# Altium project SpaceVNXBaseBoard.PrjPcb (part 4 of 6)

## Sheet Clock.SchDoc: Clocks
size A4; Author: Carlos Barreiro; Organization: Escuela Técnica Superior de Ingeniería de Sistemas Informáticos de la Universidad Politécnica de Madrid; Address1: Campus Sur de la Universidad Politécnica de Madrid; Address2: Calle de Alan Turing, s/nº; Address3: Madrid 28031; Address4: España; DocumentNumber: 12; Revision: A; SheetNumber: 12; SheetTotal: 16
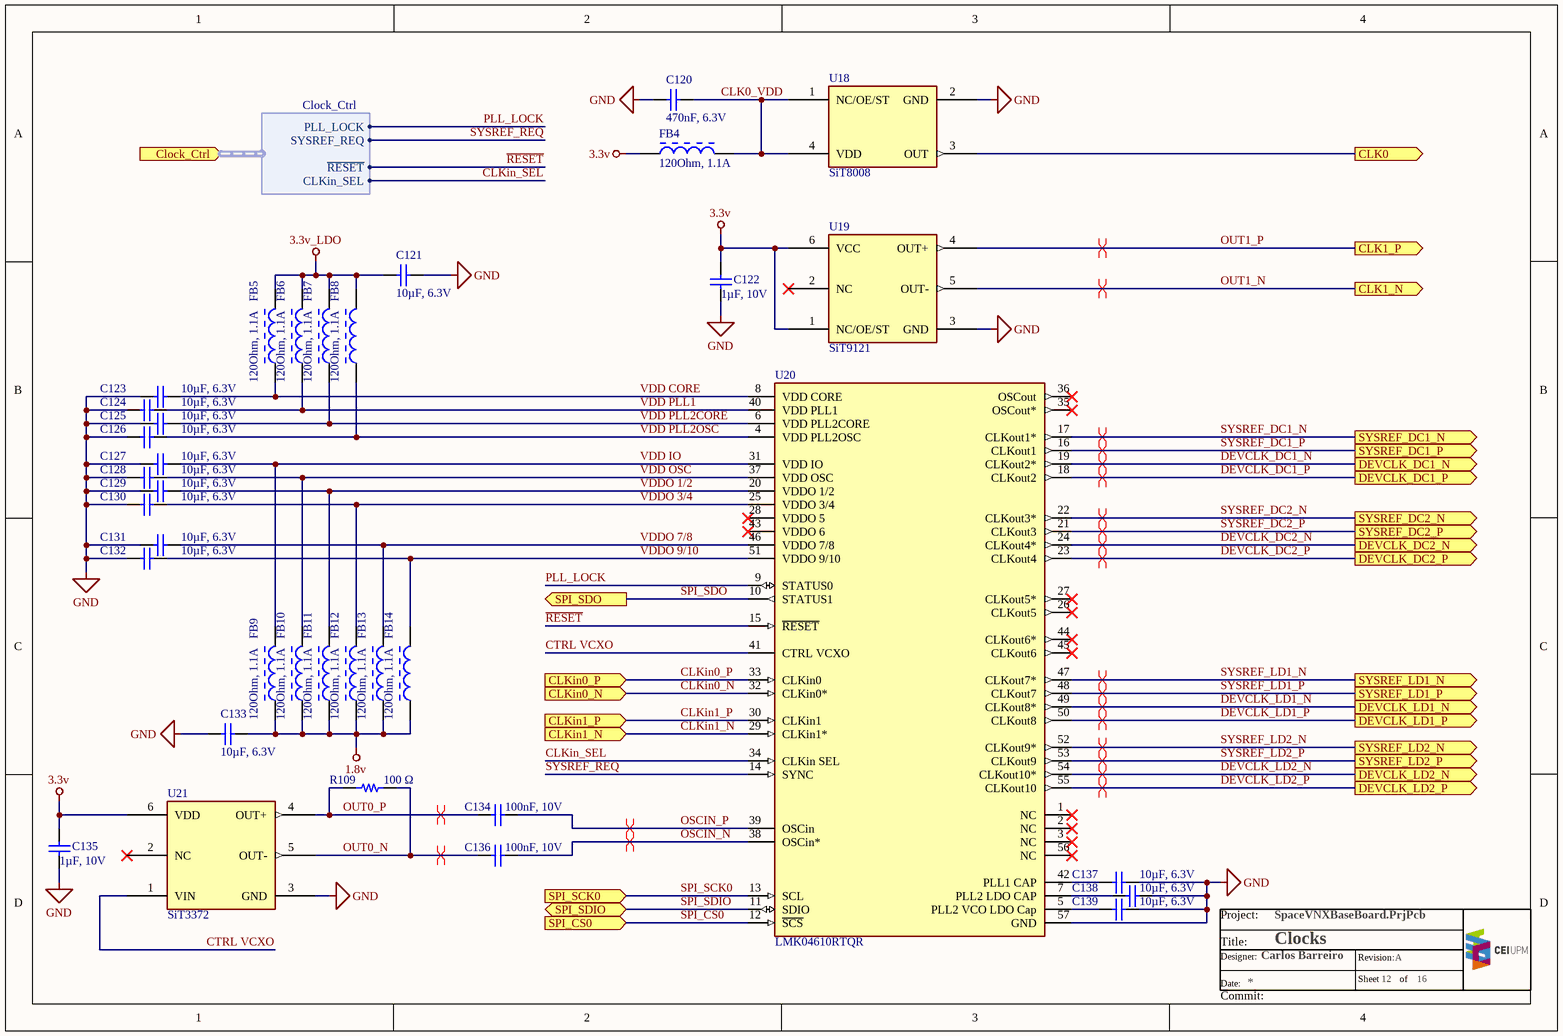
[diagram p8: Clock.SchDoc]

### Parts
C120  470nF, 6.3V  [WURTH_WCAP-CSGP_0402]
C121  10µF, 6.3V  [WURTH_WCAP-CSGP_0402]
C122  1µF, 10V  [WURTH_WCAP-CSGP_0402]
C123  10µF, 6.3V  [WURTH_WCAP-CSGP_0402]
C124  10µF, 6.3V  [WURTH_WCAP-CSGP_0402]
C125  10µF, 6.3V  [WURTH_WCAP-CSGP_0402]
C126  10µF, 6.3V  [WURTH_WCAP-CSGP_0402]
C127  10µF, 6.3V  [WURTH_WCAP-CSGP_0402]
C128  10µF, 6.3V  [WURTH_WCAP-CSGP_0402]
C129  10µF, 6.3V  [WURTH_WCAP-CSGP_0402]
C130  10µF, 6.3V  [WURTH_WCAP-CSGP_0402]
C131  10µF, 6.3V  [WURTH_WCAP-CSGP_0402]
C132  10µF, 6.3V  [WURTH_WCAP-CSGP_0402]
C133  10µF, 6.3V  [WURTH_WCAP-CSGP_0402]
C134  100nF, 10V  [WURTH_WCAP-CSGP_0402]
C135  1µF, 10V  [WURTH_WCAP-CSGP_0402]
C136  100nF, 10V  [WURTH_WCAP-CSGP_0402]
C137  10µF, 6.3V  [WURTH_WCAP-CSGP_0402]
C138  10µF, 6.3V  [WURTH_WCAP-CSGP_0402]
C139  10µF, 6.3V  [WURTH_WCAP-CSGP_0402]
FB4  120Ohm, 1.1A  [WURTH-CBF_0402]
FB5  120Ohm, 1.1A  [WURTH-CBF_0402]
FB6  120Ohm, 1.1A  [WURTH-CBF_0402]
FB7  120Ohm, 1.1A  [WURTH-CBF_0402]
FB8  120Ohm, 1.1A  [WURTH-CBF_0402]
FB9  120Ohm, 1.1A  [WURTH-CBF_0402]
FB10  120Ohm, 1.1A  [WURTH-CBF_0402]
FB11  120Ohm, 1.1A  [WURTH-CBF_0402]
FB12  120Ohm, 1.1A  [WURTH-CBF_0402]
FB13  120Ohm, 1.1A  [WURTH-CBF_0402]
FB14  120Ohm, 1.1A  [WURTH-CBF_0402]
R109  100 Ω  [PANASONIC_ERJ2G_0402]
U18  SiT8008  [SiTime_5032_4]
U19  SiT9121  [SiTime_5032_6]
U20  LMK04610RTQR  [TEXAS_VQFN56]
U21  SiT3372  [SiTime_5032_6]

### Ports
CLK0 (out), CLK1_N (out), CLK1_P (out), CLKin0_N (in), CLKin0_P (in), CLKin1_N (in), CLKin1_P (in), Clock_Ctrl (in, harness Clock_Ctrl), DEVCLK_DC1_N (out), DEVCLK_DC1_P (out), DEVCLK_DC2_N (out), DEVCLK_DC2_P (out), DEVCLK_LD1_N (out), DEVCLK_LD1_P (out), DEVCLK_LD2_N (out), DEVCLK_LD2_P (out), SPI_CS0 (in), SPI_SCK0 (in), SPI_SDIO (bidir), SPI_SDO (out), SYSREF_DC1_N (out), SYSREF_DC1_P (out), SYSREF_DC2_N (out), SYSREF_DC2_P (out), SYSREF_LD1_N (out), SYSREF_LD1_P (out), SYSREF_LD2_N (out), SYSREF_LD2_P (out)

### Harnesses
Clock_Ctrl: PLL_LOCK, SYSREF_REQ, ~{RESET}, CLKin_SEL

### Nets
1.8v: C133.2 FB9.2 FB10.2 FB11.2 FB12.2 FB13.2 FB14.2
3.3v: C122.2 C135.2 FB4.2 U19.1(NC/OE/ST) U19.6(VCC) U21.6(VDD)
3.3v_LDO: C121.1 FB5.1 FB6.1 FB7.1 FB8.1
GND: C120.1 C121.2 C122.1 C123.1 C124.1 C125.1 C126.1 C127.1 C128.1 C129.1 C130.1 C131.1 C132.1 C133.1 C135.1 C137.2 C138.2 C139.2 U18.2(GND) U19.3(GND) U20.57(GND) U21.3(GND)
CLK0: U18.3(OUT) ; port CLK0
CLK0_VDD: C120.2 FB4.1 U18.1(NC/OE/ST) U18.4(VDD)
CLKin0_N: U20.32(CLKin0*) ; port CLKin0_N
CLKin0_P: U20.33(CLKin0) ; port CLKin0_P
CLKin1_N: U20.29(CLKin1*) ; port CLKin1_N
CLKin1_P: U20.30(CLKin1) ; port CLKin1_P
CLKin_SEL: U20.34(CLKin_SEL) ; port Clock_Ctrl.CLKin_SEL
CTRL VCXO: U20.41(CTRL_VCXO) U21.1(VIN)
DEVCLK_DC1_N: U20.19(CLKout2*) ; port DEVCLK_DC1_N
DEVCLK_DC1_P: U20.18(CLKout2) ; port DEVCLK_DC1_P
DEVCLK_DC2_N: U20.24(CLKout4*) ; port DEVCLK_DC2_N
DEVCLK_DC2_P: U20.23(CLKout4) ; port DEVCLK_DC2_P
DEVCLK_LD1_N: U20.49(CLKout8*) ; port DEVCLK_LD1_N
DEVCLK_LD1_P: U20.50(CLKout8) ; port DEVCLK_LD1_P
DEVCLK_LD2_N: U20.54(CLKout10*) ; port DEVCLK_LD2_N
DEVCLK_LD2_P: U20.55(CLKout10) ; port DEVCLK_LD2_P
OSCIN_N: C136.2 U20.38(OSCin*)
OSCIN_P: C134.2 U20.39(OSCin)
OUT0_N: C136.1 R109.2 U21.5(OUT-)
OUT0_P: C134.1 R109.1 U21.4(OUT+)
OUT1_N: U19.5(OUT-) ; port CLK1_N
OUT1_P: U19.4(OUT+) ; port CLK1_P
PLL_LOCK: U20.9(STATUS0) ; port Clock_Ctrl.PLL_LOCK
~{RESET}: U20.15(~{RESET}) ; port Clock_Ctrl.~{RESET}
SPI_CS0: U20.12(~{SCS}) ; port SPI_CS0
SPI_SCK0: U20.13(SCL) ; port SPI_SCK0
SPI_SDIO: U20.11(SDIO) ; port SPI_SDIO
SPI_SDO: U20.10(STATUS1) ; port SPI_SDO
SYSREF_DC1_N: U20.17(CLKout1*) ; port SYSREF_DC1_N
SYSREF_DC1_P: U20.16(CLKout1) ; port SYSREF_DC1_P
SYSREF_DC2_N: U20.22(CLKout3*) ; port SYSREF_DC2_N
SYSREF_DC2_P: U20.21(CLKout3) ; port SYSREF_DC2_P
SYSREF_LD1_N: U20.47(CLKout7*) ; port SYSREF_LD1_N
SYSREF_LD1_P: U20.48(CLKout7) ; port SYSREF_LD1_P
SYSREF_LD2_N: U20.52(CLKout9*) ; port SYSREF_LD2_N
SYSREF_LD2_P: U20.53(CLKout9) ; port SYSREF_LD2_P
SYSREF_REQ: U20.14(SYNC) ; port Clock_Ctrl.SYSREF_REQ
VDD CORE: C123.2 FB5.2 U20.8(VDD_CORE)
VDD IO: C127.2 FB9.1 U20.31(VDD_IO)
VDD OSC: C128.2 FB10.1 U20.37(VDD_OSC)
VDD PLL1: C124.2 FB6.2 U20.40(VDD_PLL1)
VDD PLL2CORE: C125.2 FB7.2 U20.6(VDD_PLL2CORE)
VDD PLL2OSC: C126.2 FB8.2 U20.4(VDD_PLL2OSC)
VDDO 1/2: C129.2 FB11.1 U20.20(VDDO_1/2)
VDDO 3/4: C130.2 FB12.1 U20.25(VDDO_3/4)
VDDO 7/8: C131.2 FB13.1 U20.46(VDDO_7/8)
VDDO 9/10: C132.2 FB14.1 U20.51(VDDO_9/10)
NetC137_1: C137.1 U20.42(PLL1_CAP)
NetC138_1: C138.1 U20.7(PLL2_LDO_CAP)
NetC139_1: C139.1 U20.5(PLL2_VCO_LDO_Cap)

Not connected (* = marked no-connect by the designer): U19 2(NC)*; U20 1(NC)* 2(NC)* 3(NC)* 26(CLKout5)* 27(CLKout5*)* 28(VDDO_5)* 35(OSCout*)* 36(OSCout)* 43(VDDO_6)* 44(CLKout6*)* 45(CLKout6)* 56(NC)*; U21 2(NC)*

### Layout directives
differential pair: DEVCLK_DC1_N, DEVCLK_DC1_P, DEVCLK_DC2_N, DEVCLK_DC2_P, DEVCLK_LD1_N, DEVCLK_LD1_P, DEVCLK_LD2_N, DEVCLK_LD2_P, OSCIN_N, OSCIN_P, OUT0_N, OUT0_P, OUT1_N, OUT1_P, SYSREF_DC1_N, SYSREF_DC1_P, SYSREF_DC2_N, SYSREF_DC2_P, SYSREF_LD1_N, SYSREF_LD1_P, SYSREF_LD2_N, SYSREF_LD2_P

### Notes on the sheet
- Project:
- Title:
- Date:
- Designer:
- Sheet
- Revision:
- of
- Commit:

### Library data of the parts
C120 = 885012105004: WCAP-CSGP Multilayer Ceramic Chip Capacitor, General Purpose, size 0402, X5R, 470nF, 6.3V; Manufacturer: Wurth Elektronik; Rated Voltage: 6.3VDC; Isolation Resistance  min.: 0.2GOhm; Capacitance Tolerance: +/-20%; Dissipation Factor max.: 10%; Technical Reference: X5R0402474M6R3DFCT10000; ComponentLink1Description: Manufacturer; ComponentLink1URL: http://www.we-online.de; ComponentLink2Description: Datasheet; ComponentLink2URL: https://www.we-online.com/catalog/datasheet/885012105004.pdf; Operating Temperature: -55 to +85degC; Packaging: Tape and Reel; Manufacturer Part Number: 885012105004; Published Date: April 2021; Ceramic Type: X5R; Height: 0.5mm; Mounting Technology: SMT; Size: 0402; Capacitance: 470nF; Supplier 1: Digi-Key; Supplier 2: Mouser; Supplier Part Number 1: 732-7481-1-ND; Supplier Part Number 2: 710-885012105004
C121 C123-C133 C137-C139 = 885012105020: WCAP-CSGP Multilayer Ceramic Chip Capacitor, General Purpose, size 0402, X5R, 10uF, 6.3V; Manufacturer: Wurth Elektronik; Rated Voltage: 6.3VDC; Isolation Resistance  min.: 0.01GOhm; Capacitance Tolerance: +/20%; Dissipation Factor max.: 10%; Technical Reference: X5R0402106M6R3DFCT10000; ComponentLink1Description: Manufacturer; ComponentLink1URL: http://www.we-online.de; ComponentLink2Description: Datasheet; ComponentLink2URL: https://www.we-online.com/catalog/datasheet/885012105020.pdf; Operating Temperature: -55 to +85degC; Packaging: Tape and Reel; Manufacturer Part Number: 885012105020; Published Date: April 2021; Ceramic Type: X5R; Height: 0.5mm; Mounting Technology: SMT; Size: 0402; Capacitance: 10uF; Q-Factor min.: -
C122 C135 = 885012105012: WCAP-CSGP Multilayer Ceramic Chip Capacitor, General Purpose, size 0402, X5R, 1uF, 10V; Manufacturer: Wurth Elektronik; Rated Voltage: 10VDC; Isolation Resistance  min.: 0.05GOhm; Capacitance Tolerance: +/-20%; Dissipation Factor max.: 15%; Technical Reference: X5R0402105M010DFCT10000; ComponentLink1Description: Manufacturer; ComponentLink1URL: http://www.we-online.de; ComponentLink2Description: Datasheet; ComponentLink2URL: https://www.we-online.com/catalog/datasheet/885012105012.pdf; Operating Temperature: -55 to +85degC; Packaging: Tape and Reel; Manufacturer Part Number: 885012105012; Published Date: April 2021; Ceramic Type: X5R; Height: 0.5mm; Mounting Technology: SMT; Size: 0402; Capacitance: 1uF; Q-Factor min.: -; Supplier 1: Digi-Key; Supplier 2: Mouser; Supplier Part Number 2: 710-885012105012; Supplier Part Number 1: 732-7489-1-ND
C134 C136 = 885012205018: WCAP-CSGP Multilayer Ceramic Chip Capacitor, General Purpose, size 0402, X7R, 100nF, 10V; Manufacturer: Wurth Elektronik; Rated Voltage: 10VDC; Isolation Resistance  min.: 5GOhm; Capacitance Tolerance: +/-10%; Dissipation Factor max.: 5%; Technical Reference: X7R0402104K010DFCT10000; ComponentLink1Description: Manufacturer; ComponentLink1URL: http://www.we-online.de; ComponentLink2Description: Datasheet; ComponentLink2URL: https://www.we-online.com/catalog/datasheet/885012205018.pdf; Operating Temperature: -55 to +125degC; Packaging: Tape and Reel; Manufacturer Part Number: 885012205018; Published Date: April 2021; Ceramic Type: X7R; Height: 0.5mm; Mounting Technology: SMT; Size: 0402; Capacitance: 100nF; Q-Factor min.: -
FB4-FB14 = 74279271: WE-CBF SMT EMI Suppression Ferrite Bead, size 0402, 120Ohm, 1.1A; Manufacturer: Wurth Elektronik; Impedance max.: 200Ohm; DC Resistance max.: 0.2Ohm; Type: Wide Band; ComponentLink1Description: Manufacturer; ComponentLink1URL: http://www.we-online.de; ComponentLink2Description: Datasheet; ComponentLink2URL: https://www.we-online.com/catalog/datasheet/74279271.pdf; Operating Temperature: -55 to +125degC; Packaging: Tape and Reel; Published Date: December 2021; Rated Current: 1.1A; Manufacturer Part Number: 74279271; Impedance @100MHz: 120Ohm; Mounting Technology: SMT; Size: 0402; Height: 0.5mm; Length: 1mm; Width: 0.5mm
R109 = ERJ2GEJ101X: General Purpose Thick Film Chip Resistors; Manufacturer: Panasonic; Power (0402): 0.1 W; Limiting Voltage (0402): 50; Maximum Voltage (0402): 100; Resistance Range (Ω): 1Ω to 100MΩ; AEC 200: Grade 0; Size (0402): 2GE; ComponentLink1Description: Catalog; ComponentLink1URL: https://industrial.panasonic.com/ww/products/pt/general-purpose-chip-resistors/models?op=search&model_status_current=1&page=0#model-list-search-results; Series: ERJ; Temperature Range (ºC): -55 to +155; Supplier 1: Digi-Key; Supplier 2: Mouser; Supplier Part Number 2: 667-ERJ-2GEJ101X; Supplier Part Number 1: P100JTR-ND
U18 = SiT8008: Programmable oscillator, featuring wide frequency range, low power consumption, small size and excellent stability.; Frequency: 1 to 110 MHz; Frequency Stability (ppm): ±20, ±25, ±50; Phase Jitter (rms): 1.3 ps; Output Type: LVCMOS; Voltage Supply (V): 1.8V to 3.3V; Package Type (mm²): 5.0x3.2; Operating Temperature Range (°C): -40ºC to +85ºC; ComponentLink1Description: Manufacturer; ComponentLink1URL: https://www.sitime.com/products/lvcmos-oscillators/sit8008; Supplier 1: Mouser; Supplier Part Number 1: 788-8008BI2333S1000G
U19 = SiT9121: Programmable differential oscillator that supports LVPECL and LVDS output.; Oscillator Type: XO-DE; Frequency: 1 to 220 MHz; Frequency Stability (ppm): ±10, ±20, ±25, ±50; Phase Jitter (rms): 0.6 ps; Output Type: LVPECL, LVDS; Voltage Supply (V): 2.25V to 3.63V; Package Type (mm²): 5.0x3.2; Operating Temperature Range (°C): -40ºC to +85ºC; ComponentLink1Description: Manufacturer; ComponentLink1URL: https://www.sitime.com/products/lvpecl-lvds-hcsl-oscillators/sit9121; Supplier 1: Digi-Key; Supplier 2: Avnet; Supplier Part Number 1: 1473-SIT9121AI-2B3-XXS200.000000YTR-ND; Supplier Part Number 2: SIT9121AI-2B3-XXS200.000000Y
U20 = LMK04610RTQR: Ultra low-noise and low power JESD204B compliant clock jitter cleaner with dual PLLs.; Number of outputs: 10; RMS jitter (fs): 65; Output frequency (Min) (MHz): 0.03; Output frequency (Max) (MHz): 2000; Function: Dual-loop PLL; Input type: LVCMOS, LVDS, LVPECL; Output type: LVDS, LVPECL; Supply voltage (Min) (V): 1.7; Supply voltage (Max) (V): 3.465; ComponentLink1Description: Manufacturer; ComponentLink1URL: https://www.ti.com/product/LMK04828; ComponentLink2Description: Datasheet; ComponentLink2URL: https://www.ti.com/lit/ds/symlink/lmk04828.pdf?ts=1643235840450&ref_url=https%253A%252F%252Fwww.ti.com%252Fproduct%252FLMK04828; ComponentLink3Description: Package Specification; ComponentLink3URL: https://www.ti.com/lit/ml/mpqs032a/mpqs032a.pdf?ts=1643290177634&ref_url=https%253A%252F%252Fwww.ti.com%252Fpackaging%252Fdocs%252Fsearchproductbypackage.tsp%253ForderablePartNumber%253D%2526packageDesignator%253DNKD%2526pinCount%253D64%2526results%253Dresults; Operating temperature range (ºC): -40ºC to 85ºC; Supplier 1: Digi-Key; Supplier 2: Digi-Key; Supplier Part Number 1: 296-51339-1-ND; Supplier Part Number 2: 296-51339-6-ND
U21 = SiT3372: Ultra-low Jitter Differential VCXO.; Oscillator Type: VCXO-DE; Frequency: 1 to 220 MHz; Frequency Stability (ppm): ±15, ±25, ±30, ±50; Phase Jitter (rms): 0.21 ps; Output Type: LVPECL, LVDS, HCSL; Voltage Supply (V): 2.5, 2.8, 3.0, 3.3; Package Type (mm²): 5.0x3.2; Operating Temperature Range (°C): -40ºC to +85ºC; ComponentLink1Description: Manufacturer; ComponentLink1URL: https://www.sitime.com/products/lvpecl-lvds-hcsl-oscillators/sit9121; Supplier 1: Digi-Key; Supplier Part Number 1: 1473-SIT3372AI-1B3-33NZ25.000000-ND

## Sheet SpaceVNXInterface.SchDoc: SpaceVNXInterface
size A4; Author: Carlos Barreiro; Organization: Escuela Técnica Superior de Ingeniería de Sistemas Informáticos de la Universidad Politécnica de Madrid; Address1: Campus Sur de la Universidad Politécnica de Madrid; Address2: Calle de Alan Turing, s/nº; Address3: Madrid 28031; Address4: España; DocumentNumber: 10; Revision: A; SheetNumber: 10; SheetTotal: 16
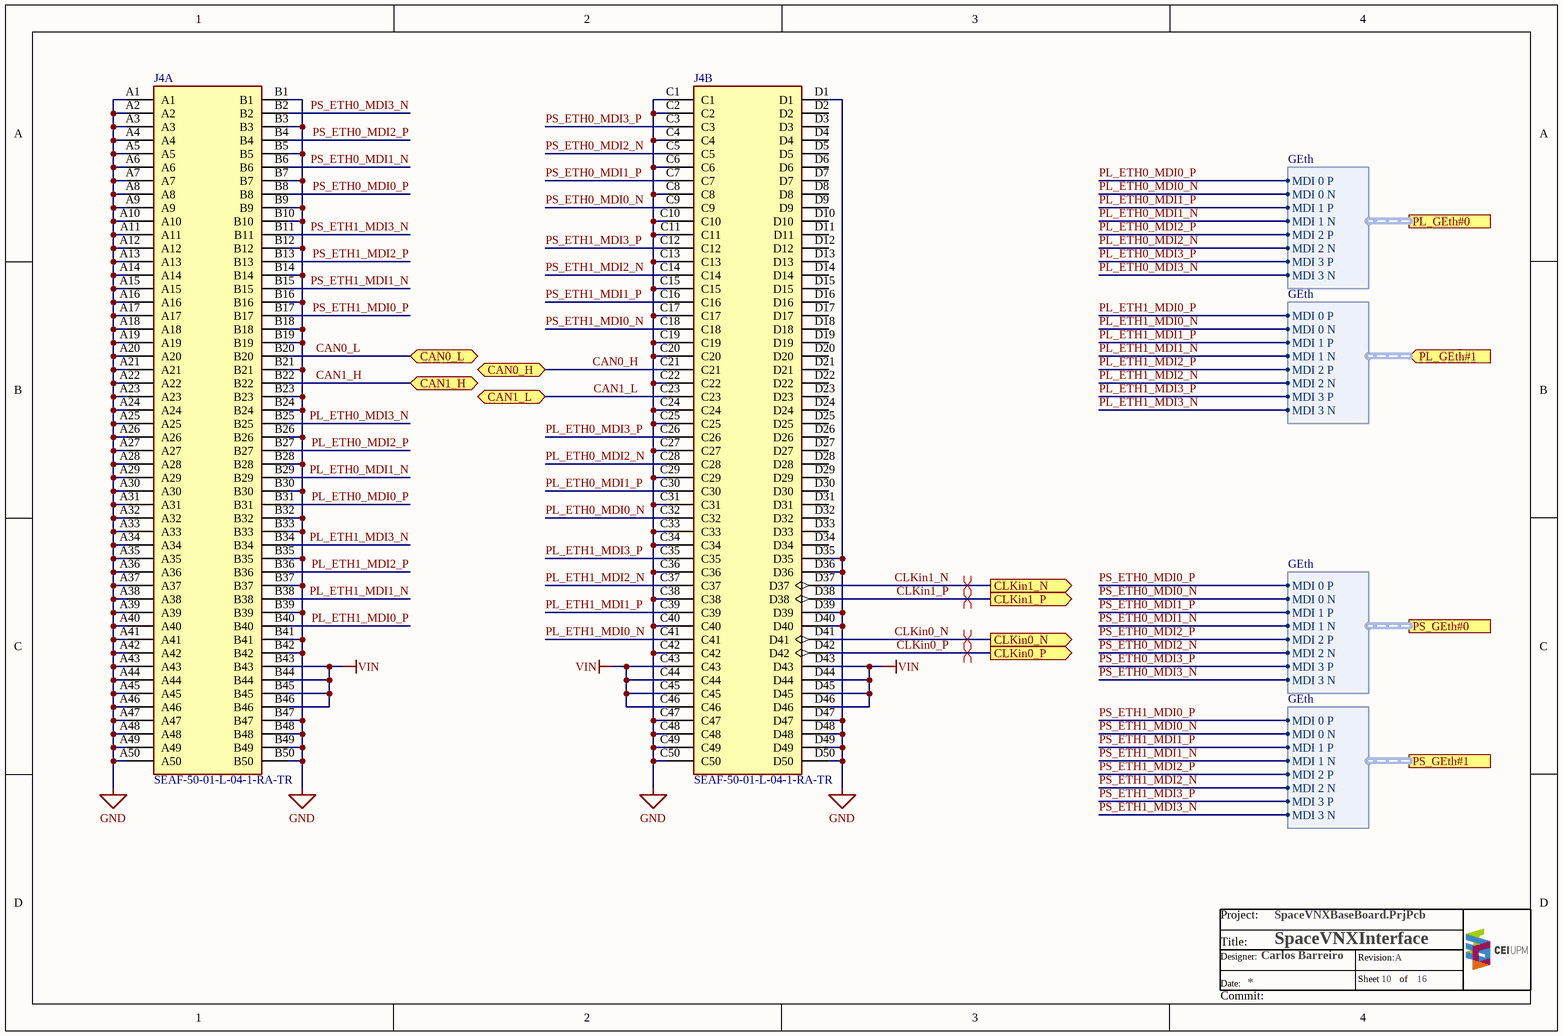
[diagram p9: SpaceVNXInterface.SchDoc]

### Parts
J4  SEAF-50-01-L-04-1-RA-TR  [SAMTEC_SEAF-50-01-L-04-1-RA-TR]  (parts A,B of 2)

### Ports
CAN0_H (bidir), CAN0_L (bidir), CAN1_H (bidir), CAN1_L (bidir), CLKin0_N (out), CLKin0_P (out), CLKin1_N (out), CLKin1_P (out), PL_GEth#0 (harness GEth), PL_GEth#1 (in, harness GEth), PS_GEth#0 (harness GEth), PS_GEth#1 (harness GEth)

### Harnesses
GEth: MDI 0 P, MDI 0 N, MDI 1 P, MDI 1 N, MDI 2 P, MDI 2 N, MDI 3 P, MDI 3 N

### Nets
GND: J4.A1 J4.A2 J4.A3 J4.A4 J4.A5 J4.A6 J4.A7 J4.A8 J4.A9 J4.A10 J4.A11 J4.A12 J4.A13 J4.A14 J4.A15 J4.A16 J4.A17 J4.A18 J4.A19 J4.A20 J4.A21 J4.A22 J4.A23 J4.A24 J4.A25 J4.A26 J4.A27 J4.A28 J4.A29 J4.A30 J4.A31 J4.A32 J4.A33 J4.A34 J4.A35 J4.A36 J4.A37 J4.A38 J4.A39 J4.A40 J4.A41 J4.A42 J4.A43 J4.A44 J4.A45 J4.A46 J4.A47 J4.A48 J4.A49 J4.A50 J4.B1 J4.B3 J4.B5 J4.B7 J4.B9 J4.B10 J4.B12 J4.B14 J4.B16 J4.B18 J4.B19 J4.B21 J4.B23 J4.B24 J4.B26 J4.B28 J4.B30 J4.B32 J4.B33 J4.B35 J4.B37 J4.B39 J4.B41 J4.B42 J4.B47 J4.B48 J4.B49 J4.B50 J4.C1 J4.C2 J4.C4 J4.C6 J4.C8 J4.C10 J4.C11 J4.C13 J4.C15 J4.C17 J4.C19 J4.C20 J4.C22 J4.C24 J4.C25 J4.C27 J4.C29 J4.C31 J4.C33 J4.C34 J4.C36 J4.C38 J4.C40 J4.C42 J4.C47 J4.C48 J4.C49 J4.C50 J4.D1 J4.D35 J4.D36 J4.D39 J4.D40 J4.D47 J4.D48 J4.D49 J4.D50
VIN: J4.B43 J4.B44 J4.B45 J4.B46 J4.C43 J4.C44 J4.C45 J4.C46 J4.D43 J4.D44 J4.D45 J4.D46
CAN0_H: J4.C21 ; port CAN0_H
CAN0_L: J4.B20 ; port CAN0_L
CAN1_H: J4.B22 ; port CAN1_H
CAN1_L: J4.C23 ; port CAN1_L
CLKin0_N: J4.D41 ; port CLKin0_N
CLKin0_P: J4.D42 ; port CLKin0_P
CLKin1_N: J4.D37 ; port CLKin1_N
CLKin1_P: J4.D38 ; port CLKin1_P
PL_ETH0_MDI0_N: J4.C32 ; port PL_GEth#0.MDI 0 N
PL_ETH0_MDI0_P: J4.B31 ; port PL_GEth#0.MDI 0 P
PL_ETH0_MDI1_N: J4.B29 ; port PL_GEth#0.MDI 1 N
PL_ETH0_MDI1_P: J4.C30 ; port PL_GEth#0.MDI 1 P
PL_ETH0_MDI2_N: J4.C28 ; port PL_GEth#0.MDI 2 N
PL_ETH0_MDI2_P: J4.B27 ; port PL_GEth#0.MDI 2 P
PL_ETH0_MDI3_N: J4.B25 ; port PL_GEth#0.MDI 3 N
PL_ETH0_MDI3_P: J4.C26 ; port PL_GEth#0.MDI 3 P
PL_ETH1_MDI0_N: J4.C41 ; port PL_GEth#1.MDI 0 N
PL_ETH1_MDI0_P: J4.B40 ; port PL_GEth#1.MDI 0 P
PL_ETH1_MDI1_N: J4.B38 ; port PL_GEth#1.MDI 1 N
PL_ETH1_MDI1_P: J4.C39 ; port PL_GEth#1.MDI 1 P
PL_ETH1_MDI2_N: J4.C37 ; port PL_GEth#1.MDI 2 N
PL_ETH1_MDI2_P: J4.B36 ; port PL_GEth#1.MDI 2 P
PL_ETH1_MDI3_N: J4.B34 ; port PL_GEth#1.MDI 3 N
PL_ETH1_MDI3_P: J4.C35 ; port PL_GEth#1.MDI 3 P
PS_ETH0_MDI0_N: J4.C9 ; port PS_GEth#0.MDI 0 N
PS_ETH0_MDI0_P: J4.B8 ; port PS_GEth#0.MDI 0 P
PS_ETH0_MDI1_N: J4.B6 ; port PS_GEth#0.MDI 1 N
PS_ETH0_MDI1_P: J4.C7 ; port PS_GEth#0.MDI 1 P
PS_ETH0_MDI2_N: J4.C5 ; port PS_GEth#0.MDI 2 N
PS_ETH0_MDI2_P: J4.B4 ; port PS_GEth#0.MDI 2 P
PS_ETH0_MDI3_N: J4.B2 ; port PS_GEth#0.MDI 3 N
PS_ETH0_MDI3_P: J4.C3 ; port PS_GEth#0.MDI 3 P
PS_ETH1_MDI0_N: J4.C18 ; port PS_GEth#1.MDI 0 N
PS_ETH1_MDI0_P: J4.B17 ; port PS_GEth#1.MDI 0 P
PS_ETH1_MDI1_N: J4.B15 ; port PS_GEth#1.MDI 1 N
PS_ETH1_MDI1_P: J4.C16 ; port PS_GEth#1.MDI 1 P
PS_ETH1_MDI2_N: J4.C14 ; port PS_GEth#1.MDI 2 N
PS_ETH1_MDI2_P: J4.B13 ; port PS_GEth#1.MDI 2 P
PS_ETH1_MDI3_N: J4.B11 ; port PS_GEth#1.MDI 3 N
PS_ETH1_MDI3_P: J4.C12 ; port PS_GEth#1.MDI 3 P

Not connected (* = marked no-connect by the designer): J4 D2 D3 D4 D5 D6 D7 D8 D9 D10 D11 D12 D13 D14 D15 D16 D17 D18 D19 D20 D21 D22 D23 D24 D25 D26 D27 D28 D29 D30 D31 D32 D33 D34

### Layout directives
differential pair: CLKin0_N, CLKin0_P, CLKin1_N, CLKin1_P

### Notes on the sheet
- Project:
- Title:
- Date:
- Designer:
- Sheet
- Revision:
- of
- Commit:

### Library data of the parts
J4 = SEAF-50-01-L-04-1-RA-TR: 200 Position Connector High Density Array, Female Surface Mount, Right Angle Gold  <a href="https://pricing.snapeda.com/parts/SEAF-50-01-L-04-1-RA-K-TR/Samtec/view-part?ref=eda">Check prices</a>; Supplier 1: Digi-Key; Supplier Part Number 1: SEAF-50-01-L-04-1-RA-TR-ND; System: Connector

## Sheet CPLD.SchDoc: CPLD
size A4 portrait; Author: Carlos Barreiro; DocumentNumber: 13; Revision: A; SheetNumber: 13; SheetTotal: 16; Organization: Escuela Técnica Superior de Ingeniería de Sistemas Informáticos de la Universidad Politécnica de Madrid; Address1: Campus Sur de la Universidad Politécnica de Madrid; Address2: Calle de Alan Turing, s/nº; Address3: Madrid 28031; Address4: España
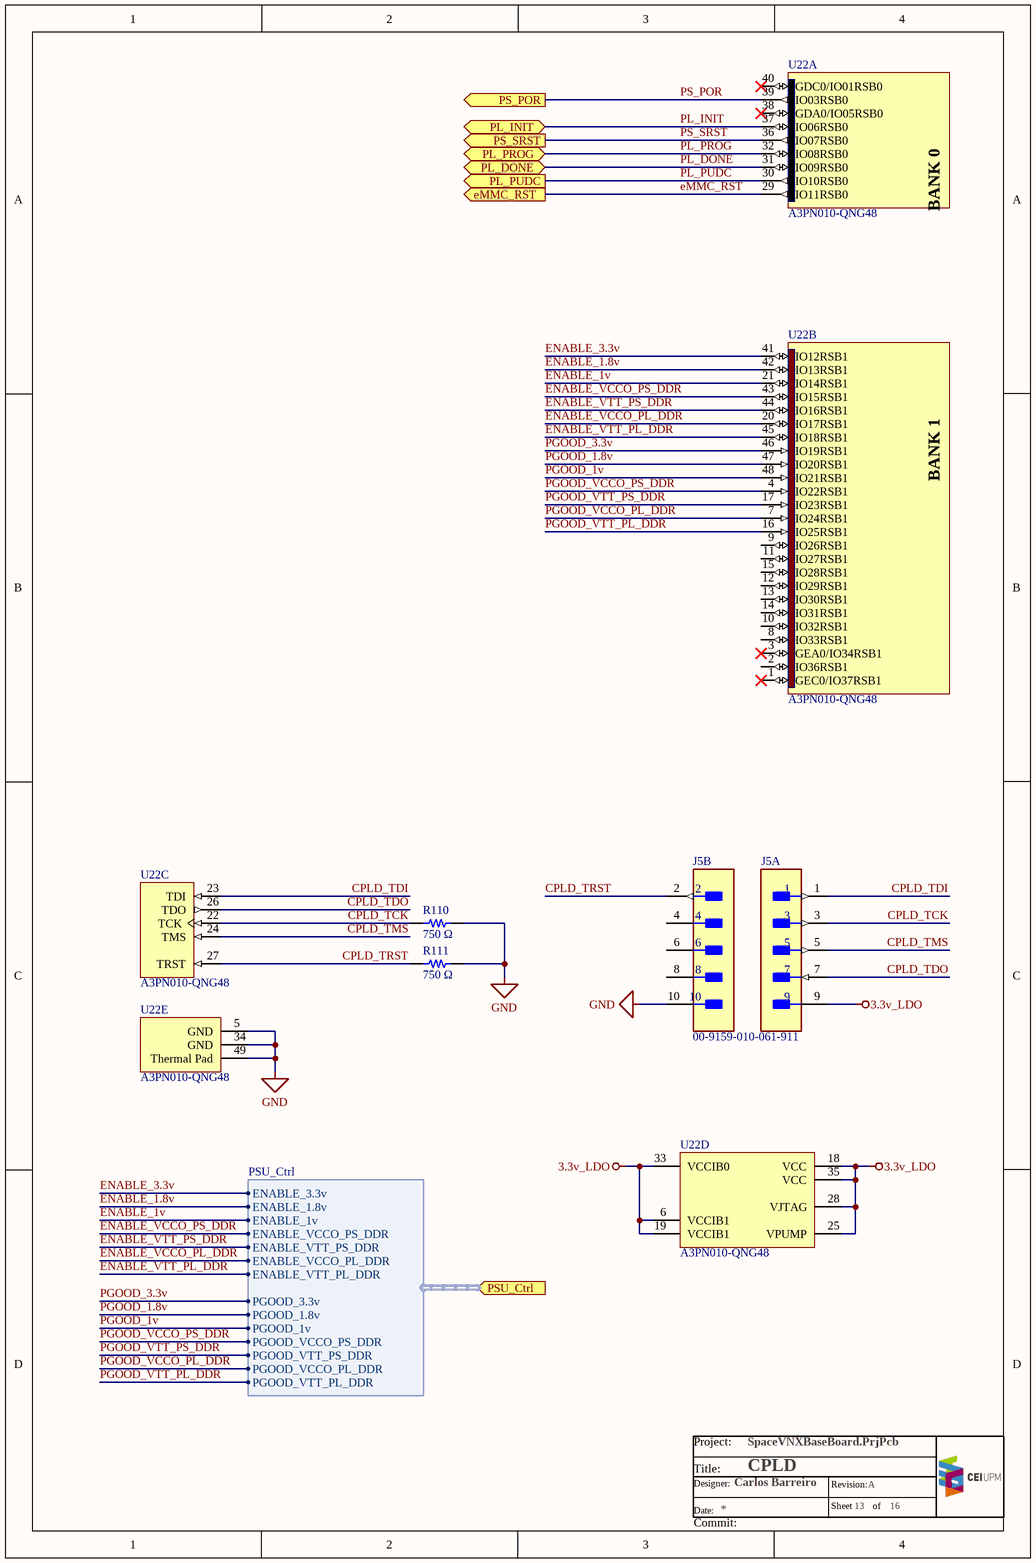
[diagram p10: CPLD.SchDoc]

### Parts
J5  00-9159-010-061-911  [KYOCERA_00-9159-010-061-911]  (value not drawn)  (parts A,B of 2)
R110  750 Ω  [PANASONIC_ERJ2G_0402]
R111  750 Ω  [PANASONIC_ERJ2G_0402]
U22  A3PN010-QNG48  [Actel_QN48]  (parts A,B,C,D,E of 5)

### Ports
eMMC_RST (out), PL_DONE (bidir), PL_INIT (bidir), PL_PROG (bidir), PL_PUDC (out), PS_POR (out), PS_SRST (out), PSU_Ctrl (in, harness PSU_Ctrl)

### Harnesses
PSU_Ctrl: ENABLE_3.3v, ENABLE_1.8v, ENABLE_1v, ENABLE_VTT_PS_DDR, ENABLE_VCCO_PL_DDR, PGOOD_3.3v, PGOOD_1.8v, PGOOD_1v, PGOOD_VCCO_PL_DDR, PGOOD_VTT_PL_DDR, PGOOD_VTT_PS_DDR, PGOOD_VCCO_PS_DDR, ENABLE_VCCO_PS_DDR, ENABLE_VTT_PL_DDR

### Nets
3.3v_LDO: J5.9 U22.6(VCCIB1) U22.18(VCC) U22.19(VCCIB1) U22.25(VPUMP) U22.28(VJTAG) U22.33(VCCIB0) U22.35(VCC)
GND: J5.10 R110.2 R111.2 U22.5(GND) U22.34(GND) U22.49(Thermal_Pad)
CPLD_TCK: J5.3 R110.1 U22.22(TCK)
CPLD_TDI: J5.1 U22.23(TDI)
CPLD_TDO: J5.7 U22.26(TDO)
CPLD_TMS: J5.5 U22.24(TMS)
CPLD_TRST: J5.2 R111.1 U22.27(TRST)
eMMC_RST: U22.29(IO11RSB0) ; port eMMC_RST
ENABLE_1.8v: U22.42(IO13RSB1) ; port PSU_Ctrl.ENABLE_1.8v
ENABLE_1v: U22.21(IO14RSB1) ; port PSU_Ctrl.ENABLE_1v
ENABLE_3.3v: U22.41(IO12RSB1) ; port PSU_Ctrl.ENABLE_3.3v
ENABLE_VCCO_PL_DDR: U22.20(IO17RSB1) ; port PSU_Ctrl.ENABLE_VCCO_PL_DDR
ENABLE_VCCO_PS_DDR: U22.43(IO15RSB1) ; port PSU_Ctrl.ENABLE_VCCO_PS_DDR
ENABLE_VTT_PL_DDR: U22.45(IO18RSB1) ; port PSU_Ctrl.ENABLE_VTT_PL_DDR
ENABLE_VTT_PS_DDR: U22.44(IO16RSB1) ; port PSU_Ctrl.ENABLE_VTT_PS_DDR
PGOOD_1.8v: U22.47(IO20RSB1) ; port PSU_Ctrl.PGOOD_1.8v
PGOOD_1v: U22.48(IO21RSB1) ; port PSU_Ctrl.PGOOD_1v
PGOOD_3.3v: U22.46(IO19RSB1) ; port PSU_Ctrl.PGOOD_3.3v
PGOOD_VCCO_PL_DDR: U22.7(IO24RSB1) ; port PSU_Ctrl.PGOOD_VCCO_PL_DDR
PGOOD_VCCO_PS_DDR: U22.4(IO22RSB1) ; port PSU_Ctrl.PGOOD_VCCO_PS_DDR
PGOOD_VTT_PL_DDR: U22.16(IO25RSB1) ; port PSU_Ctrl.PGOOD_VTT_PL_DDR
PGOOD_VTT_PS_DDR: U22.17(IO23RSB1) ; port PSU_Ctrl.PGOOD_VTT_PS_DDR
PL_DONE: U22.31(IO09RSB0) ; port PL_DONE
PL_INIT: U22.37(IO06RSB0) ; port PL_INIT
PL_PROG: U22.32(IO08RSB0) ; port PL_PROG
PL_PUDC: U22.30(IO10RSB0) ; port PL_PUDC
PS_POR: U22.39(IO03RSB0) ; port PS_POR
PS_SRST: U22.36(IO07RSB0) ; port PS_SRST

Not connected (* = marked no-connect by the designer): J5 4 6 8; U22 1(GEC0/IO37RSB1)* 2(IO36RSB1) 3(GEA0/IO34RSB1)* 8(IO33RSB1) 9(IO26RSB1) 10(IO32RSB1) 11(IO27RSB1) 12(IO29RSB1) 13(IO30RSB1) 14(IO31RSB1) 15(IO28RSB1) 38(GDA0/IO05RSB0)* 40(GDC0/IO01RSB0)*

### Notes on the sheet
- Project:
- Title:
- Date:
- Designer:
- Sheet
- Revision:
- of
- Commit:
- (in symbol A3PN010-QNG48, part A) BANK 0
- (in symbol A3PN010-QNG48, part B) BANK 1

### Library data of the parts
J5 = 00-9159-010-061-911: Coplanar Open Ended Card Edge Connector 10 Pin; Supplier 1: Digi-Key; Supplier Part Number 1: 478-009159010061911-ND
R110 R111 = ERJ2RKF7500X: General Purpose Thick Film Chip Resistors; Manufacturer: Panasonic; Power (0402): 0.1 W; Limiting Voltage (0402): 50; Maximum Voltage (0402): 100; Resistance Range (Ω): 1Ω to 100MΩ; AEC 200: Grade 0; Size (0402): 2GE; ComponentLink1Description: Catalog; ComponentLink1URL: https://industrial.panasonic.com/ww/products/pt/general-purpose-chip-resistors/models?op=search&model_status_current=1&page=0#model-list-search-results; Series: ERJ; Temperature Range (ºC): -55 to +155; Supplier 1: Avnet; Supplier Part Number 1: 73T6541
U22 = A3PN010-QNG48: ProASIC3 nano Flash FPGA, 34 User IOs, 10K System Gates, Standard Speed, 48-Pin QFP, Pb-Free, Commerical Grade; System Gates: 100.000; Equivalent LEs: 100; FlashROM Bits: 1024; Maximum User I/Os: 34; ComponentLink1Description: Manufacturer; ComponentLink1URL: https://www.microsemi.com/product-directory/fpgas/1690-proasic3#proasic3-nano; Supplier 1: Digi-Key; Supplier Part Number 1: 1100-1258-ND; Package: QNG48

## Sheet PowerSupply.SchDoc: PowerSupply
size A3; Author: Carlos Barreiro; Organization: Escuela Técnica Superior de Ingeniería de Sistemas Informáticos de la Universidad Politécnica de Madrid; Address1: Campus Sur de la Universidad Politécnica de Madrid; Address2: Calle de Alan Turing, s/nº; Address3: Madrid 28031; Address4: España; DocumentNumber: 11; SheetNumber: 11; SheetTotal: 16
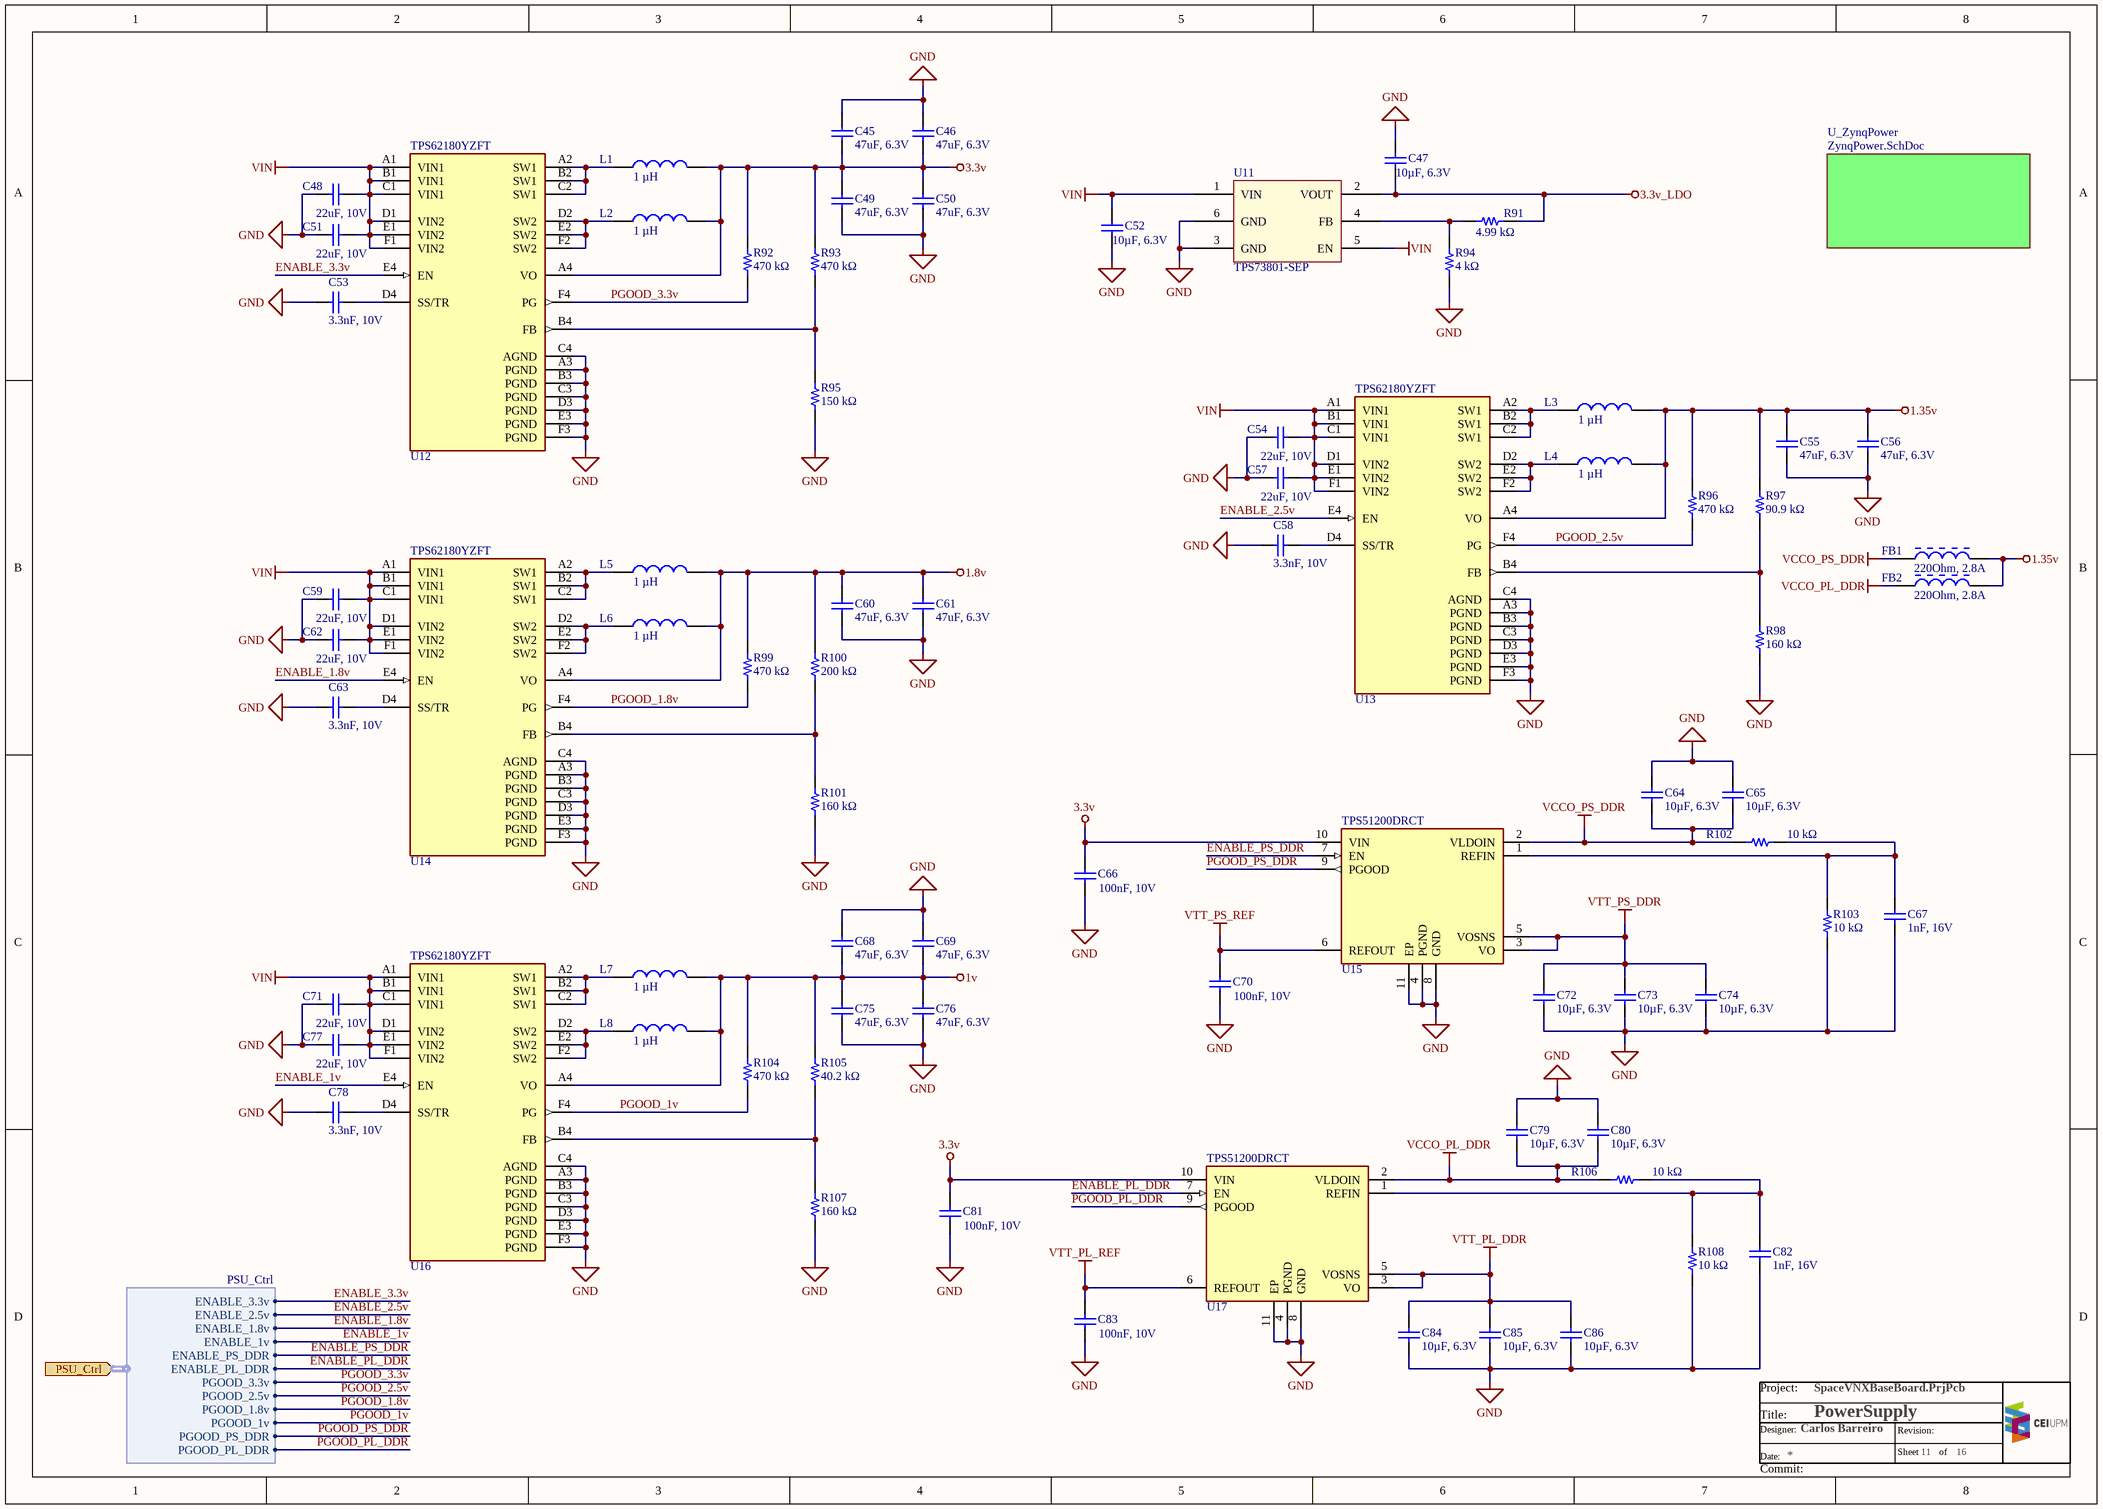
[diagram p11: PowerSupply.SchDoc]

### Parts
C45  47uF, 6.3V  [WURTH_WCAP-CSGP_0805_H=1.25mm]
C46  47uF, 6.3V  [WURTH_WCAP-CSGP_0805_H=1.25mm]
C47  10µF, 6.3V  [WURTH_WCAP-CSGP_0402]
C48  22uF, 10V  [WURTH_WCAP-CSGP_0805_H=1.25mm]
C49  47uF, 6.3V  [WURTH_WCAP-CSGP_0805_H=1.25mm]
C50  47uF, 6.3V  [WURTH_WCAP-CSGP_0805_H=1.25mm]
C51  22uF, 10V  [WURTH_WCAP-CSGP_0805_H=1.25mm]
C52  10µF, 6.3V  [WURTH_WCAP-CSGP_0402]
C53  3.3nF, 10V  [WURTH_WCAP-CSGP_0402]
C54  22uF, 10V  [WURTH_WCAP-CSGP_0805_H=1.25mm]
C55  47uF, 6.3V  [WURTH_WCAP-CSGP_0805_H=1.25mm]
C56  47uF, 6.3V  [WURTH_WCAP-CSGP_0805_H=1.25mm]
C57  22uF, 10V  [WURTH_WCAP-CSGP_0805_H=1.25mm]
C58  3.3nF, 10V  [WURTH_WCAP-CSGP_0402]
C59  22uF, 10V  [WURTH_WCAP-CSGP_0805_H=1.25mm]
C60  47uF, 6.3V  [WURTH_WCAP-CSGP_0805_H=1.25mm]
C61  47uF, 6.3V  [WURTH_WCAP-CSGP_0805_H=1.25mm]
C62  22uF, 10V  [WURTH_WCAP-CSGP_0805_H=1.25mm]
C63  3.3nF, 10V  [WURTH_WCAP-CSGP_0402]
C64  10µF, 6.3V  [WURTH_WCAP-CSGP_0402]
C65  10µF, 6.3V  [WURTH_WCAP-CSGP_0402]
C66  100nF, 10V  [WURTH_WCAP-CSGP_0402]
C67  1nF, 16V  [WURTH_WCAP-CSGP_0402]
C68  47uF, 6.3V  [WURTH_WCAP-CSGP_0805_H=1.25mm]
C69  47uF, 6.3V  [WURTH_WCAP-CSGP_0805_H=1.25mm]
C70  100nF, 10V  [WURTH_WCAP-CSGP_0402]
C71  22uF, 10V  [WURTH_WCAP-CSGP_0805_H=1.25mm]
C72  10µF, 6.3V  [WURTH_WCAP-CSGP_0402]
C73  10µF, 6.3V  [WURTH_WCAP-CSGP_0402]
C74  10µF, 6.3V  [WURTH_WCAP-CSGP_0402]
C75  47uF, 6.3V  [WURTH_WCAP-CSGP_0805_H=1.25mm]
C76  47uF, 6.3V  [WURTH_WCAP-CSGP_0805_H=1.25mm]
C77  22uF, 10V  [WURTH_WCAP-CSGP_0805_H=1.25mm]
C78  3.3nF, 10V  [WURTH_WCAP-CSGP_0402]
C79  10µF, 6.3V  [WURTH_WCAP-CSGP_0402]
C80  10µF, 6.3V  [WURTH_WCAP-CSGP_0402]
C81  100nF, 10V  [WURTH_WCAP-CSGP_0402]
C82  1nF, 16V  [WURTH_WCAP-CSGP_0402]
C83  100nF, 10V  [WURTH_WCAP-CSGP_0402]
C84  10µF, 6.3V  [WURTH_WCAP-CSGP_0402]
C85  10µF, 6.3V  [WURTH_WCAP-CSGP_0402]
C86  10µF, 6.3V  [WURTH_WCAP-CSGP_0402]
FB1  220Ohm, 2.8A  [WURTH-CBF_0805]
FB2  220Ohm, 2.8A  [WURTH-CBF_0805]
L1  1 µH  [Murata_LQH2HPN_JR]
L2  1 µH  [Murata_LQH2HPN_JR]
L3  1 µH  [Murata_LQH2HPN_JR]
L4  1 µH  [Murata_LQH2HPN_JR]
L5  1 µH  [Murata_LQH2HPN_JR]
L6  1 µH  [Murata_LQH2HPN_JR]
L7  1 µH  [Murata_LQH2HPN_JR]
L8  1 µH  [Murata_LQH2HPN_JR]
R91  4.99 kΩ  [PANASONIC_ERJ2G_0402]
R92  470 kΩ  [PANASONIC_ERJ2G_0402]
R93  470 kΩ  [PANASONIC_ERJ2G_0402]
R94  4 kΩ  [PANASONIC_ERJ2G_0402]
R95  150 kΩ  [PANASONIC_ERJ2G_0402]
R96  470 kΩ  [PANASONIC_ERJ2G_0402]
R97  90.9 kΩ  [PANASONIC_ERJ2G_0402]
R98  160 kΩ  [PANASONIC_ERJ2G_0402]
R99  470 kΩ  [PANASONIC_ERJ2G_0402]
R100  200 kΩ  [PANASONIC_ERJ2G_0402]
R101  160 kΩ  [PANASONIC_ERJ2G_0402]
R102  10 kΩ  [PANASONIC_ERJ2G_0402]
R103  10 kΩ  [PANASONIC_ERJ2G_0402]
R104  470 kΩ  [PANASONIC_ERJ2G_0402]
R105  40.2 kΩ  [PANASONIC_ERJ2G_0402]
R106  10 kΩ  [PANASONIC_ERJ2G_0402]
R107  160 kΩ  [PANASONIC_ERJ2G_0402]
R108  10 kΩ  [PANASONIC_ERJ2G_0402]
U11  TPS73801-SEP  [TEXAS_SOT223DCQ]
U12  TPS62180YZFT  [TEXAS_DSBGA24]
U13  TPS62180YZFT  [TEXAS_DSBGA24]
U14  TPS62180YZFT  [TEXAS_DSBGA24]
U15  TPS51200DRCT  [TEXAS_VSON10]
U16  TPS62180YZFT  [TEXAS_DSBGA24]
U17  TPS51200DRCT  [TEXAS_VSON10]

### Sub-sheets
U_ZynqPower = ZynqPower.SchDoc: no entries

### Ports
PSU_Ctrl (in, harness PSU_Ctrl)

### Harnesses
PSU_Ctrl: ENABLE_3.3v, ENABLE_2.5v, ENABLE_1.8v, ENABLE_1v, ENABLE_PS_DDR, ENABLE_PL_DDR, PGOOD_3.3v, PGOOD_2.5v, PGOOD_1.8v, PGOOD_1v, PGOOD_PS_DDR, PGOOD_PL_DDR

### Nets
1.8v: C60.2 C61.2 L5.2 L6.2 R99.2 R100.2 U14.A4(VO)
1.35v: C55.2 C56.2 FB1.2 FB2.2 L3.2 L4.2 R96.2 R97.2 U13.A4(VO)
1v: C68.1 C69.1 C75.2 C76.2 L7.2 L8.2 R104.2 R105.2 U16.A4(VO)
3.3v: C45.1 C46.1 C49.2 C50.2 C66.2 C81.2 L1.2 L2.2 R92.2 R93.2 U12.A4(VO) U15.10(VIN) U17.10(VIN)
3.3v_LDO: C47.1 R91.2 U11.2(VOUT)
GND: C45.2 C46.2 C47.2 C48.2 C49.1 C50.1 C51.2 C52.1 C53.1 C54.2 C55.1 C56.1 C57.2 C58.1 C59.2 C60.1 C61.1 C62.2 C63.1 C64.1 C65.1 C66.1 C67.2 C68.2 C69.2 C70.1 C71.2 C72.1 C73.1 C74.1 C75.1 C76.1 C77.2 C78.1 C79.1 C80.1 C81.1 C82.2 C83.1 C84.1 C85.1 C86.1 R94.2 R95.1 R98.1 R101.1 R103.1 R107.1 R108.1 U11.3(GND) U11.6(GND) U12.A3(PGND) U12.B3(PGND) U12.C3(PGND) U12.C4(AGND) U12.D3(PGND) U12.E3(PGND) U12.F3(PGND) U13.A3(PGND) U13.B3(PGND) U13.C3(PGND) U13.C4(AGND) U13.D3(PGND) U13.E3(PGND) U13.F3(PGND) U14.A3(PGND) U14.B3(PGND) U14.C3(PGND) U14.C4(AGND) U14.D3(PGND) U14.E3(PGND) U14.F3(PGND) U15.4(PGND) U15.8(GND) U15.11(EP) U16.A3(PGND) U16.B3(PGND) U16.C3(PGND) U16.C4(AGND) U16.D3(PGND) U16.E3(PGND) U16.F3(PGND) U17.4(PGND) U17.8(GND) U17.11(EP)
VCCO_PL_DDR: C79.2 C80.2 FB2.1 R106.1 U17.2(VLDOIN)
VCCO_PS_DDR: C64.2 C65.2 FB1.1 R102.1 U15.2(VLDOIN)
VIN: C48.1 C51.1 C52.2 C54.1 C57.1 C59.1 C62.1 C71.1 C77.1 U11.1(VIN) U11.5(EN) U12.A1(VIN1) U12.B1(VIN1) U12.C1(VIN1) U12.D1(VIN2) U12.E1(VIN2) U12.F1(VIN2) U13.A1(VIN1) U13.B1(VIN1) U13.C1(VIN1) U13.D1(VIN2) U13.E1(VIN2) U13.F1(VIN2) U14.A1(VIN1) U14.B1(VIN1) U14.C1(VIN1) U14.D1(VIN2) U14.E1(VIN2) U14.F1(VIN2) U16.A1(VIN1) U16.B1(VIN1) U16.C1(VIN1) U16.D1(VIN2) U16.E1(VIN2) U16.F1(VIN2)
VTT_PL_DDR: C84.2 C85.2 C86.2 U17.3(VO) U17.5(VOSNS)
VTT_PL_REF: C83.2 U17.6(REFOUT)
VTT_PS_DDR: C72.2 C73.2 C74.2 U15.3(VO) U15.5(VOSNS)
VTT_PS_REF: C70.2 U15.6(REFOUT)
ENABLE_1.8v: U14.E4(EN) ; port PSU_Ctrl.ENABLE_1.8v
ENABLE_1v: U16.E4(EN) ; port PSU_Ctrl.ENABLE_1v
ENABLE_2.5v: U13.E4(EN) ; port PSU_Ctrl.ENABLE_2.5v
ENABLE_3.3v: U12.E4(EN) ; port PSU_Ctrl.ENABLE_3.3v
ENABLE_PL_DDR: U17.7(EN) ; port PSU_Ctrl.ENABLE_PL_DDR
ENABLE_PS_DDR: U15.7(EN) ; port PSU_Ctrl.ENABLE_PS_DDR
PGOOD_1.8v: R99.1 U14.F4(PG) ; port PSU_Ctrl.PGOOD_1.8v
PGOOD_1v: R104.1 U16.F4(PG) ; port PSU_Ctrl.PGOOD_1v
PGOOD_2.5v: R96.1 U13.F4(PG) ; port PSU_Ctrl.PGOOD_2.5v
PGOOD_3.3v: R92.1 U12.F4(PG) ; port PSU_Ctrl.PGOOD_3.3v
PGOOD_PL_DDR: U17.9(PGOOD) ; port PSU_Ctrl.PGOOD_PL_DDR
PGOOD_PS_DDR: U15.9(PGOOD) ; port PSU_Ctrl.PGOOD_PS_DDR
NetC53_2: C53.2 U12.D4(SS/TR)
NetC58_2: C58.2 U13.D4(SS/TR)
NetC63_2: C63.2 U14.D4(SS/TR)
NetC67_1: C67.1 R102.2 R103.2 U15.1(REFIN)
NetC78_2: C78.2 U16.D4(SS/TR)
NetC82_1: C82.1 R106.2 R108.2 U17.1(REFIN)
NetL1_1: L1.1 U12.A2(SW1) U12.B2(SW1) U12.C2(SW1)
NetL2_1: L2.1 U12.D2(SW2) U12.E2(SW2) U12.F2(SW2)
NetL3_1: L3.1 U13.A2(SW1) U13.B2(SW1) U13.C2(SW1)
NetL4_1: L4.1 U13.D2(SW2) U13.E2(SW2) U13.F2(SW2)
NetL5_1: L5.1 U14.A2(SW1) U14.B2(SW1) U14.C2(SW1)
NetL6_1: L6.1 U14.D2(SW2) U14.E2(SW2) U14.F2(SW2)
NetL7_1: L7.1 U16.A2(SW1) U16.B2(SW1) U16.C2(SW1)
NetL8_1: L8.1 U16.D2(SW2) U16.E2(SW2) U16.F2(SW2)
NetR91_1: R91.1 R94.1 U11.4(FB)
NetR93_1: R93.1 R95.2 U12.B4(FB)
NetR97_1: R97.1 R98.2 U13.B4(FB)
NetR100_1: R100.1 R101.2 U14.B4(FB)
NetR105_1: R105.1 R107.2 U16.B4(FB)

### Notes on the sheet
- Project:
- Title:
- Date:
- Designer:
- Sheet
- Revision:
- of
- Commit:

### Library data of the parts
C45 C46 C49 C50 C55 C56 C60 C61 C68 C69 C75 C76 = 885012107006: WCAP-CSGP Multilayer Ceramic Chip Capacitor, General Purpose, size 0805, X5R, 47uF, 6.3V; Manufacturer: Wurth Elektronik; Rated Voltage: 6.3VDC; Isolation Resistance  min.: 0.002GOhm; Capacitance Tolerance: +/-20%; Dissipation Factor max.: 10%; Technical Reference: X5R0805476M6R3DFCT10000; ComponentLink1Description: Manufacturer; ComponentLink1URL: http://www.we-online.de; ComponentLink2Description: Datasheet; ComponentLink2URL: https://www.we-online.com/catalog/datasheet/885012107006.pdf; Operating Temperature: -55 to +85degC; Packaging: Tape and Reel; Manufacturer Part Number: 885012107006; Published Date: April 2021; Ceramic Type: X5R; Height: 1.25mm; Mounting Technology: SMT; Size: 0805; Capacitance: 47uF; Q-Factor min.: -
C47 C52 C64 C65 C72-C74 C79 C80 C84-C86 = 885012105020: as C121 on sheet Clock; ComponentLink1Description: Manufacturer; ComponentLink1URL: http://www.we-online.de; ComponentLink2Description: Datasheet; ComponentLink2URL: https://www.we-online.com/catalog/datasheet/885012105020.pdf; Operating Temperature: -55 to +85degC; Packaging: Tape and Reel; Manufacturer Part Number: 885012105020; Published Date: April 2021; Ceramic Type: X5R; Height: 0.5mm; Mounting Technology: SMT; Size: 0402; Capacitance: 10uF; Q-Factor min.: -
C48 C51 C54 C57 C59 C62 C71 C77 = 885012107011: WCAP-CSGP Multilayer Ceramic Chip Capacitor, General Purpose, size 0805, X5R, 22uF, 10V; Manufacturer: Wurth Elektronik; Rated Voltage: 10VDC; Isolation Resistance  min.: 0.005GOhm; Capacitance Tolerance: +/-20%; Dissipation Factor max.: 10%; Technical Reference: X5R0805226M010DFCT10000; ComponentLink1Description: Manufacturer; ComponentLink1URL: http://www.we-online.de; ComponentLink2Description: Datasheet; ComponentLink2URL: https://www.we-online.com/catalog/datasheet/885012107011.pdf; Operating Temperature: -55 to +85degC; Packaging: Tape and Reel; Manufacturer Part Number: 885012107011; Published Date: April 2021; Ceramic Type: X5R; Height: 1.25mm; Mounting Technology: SMT; Size: 0805; Capacitance: 22uF; Q-Factor min.: -
C53 C58 C63 C78 = 885012205009: WCAP-CSGP Multilayer Ceramic Chip Capacitor, General Purpose, size 0402, X7R, 3.3nF, 10V; Manufacturer: Wurth Elektronik; Rated Voltage: 10VDC; Isolation Resistance  min.: 10GOhm; Capacitance Tolerance: +/-10%; Dissipation Factor max.: 5%; Technical Reference: X7R0402332K010DFCT10000; ComponentLink1Description: Manufacturer; ComponentLink1URL: http://www.we-online.de; ComponentLink2Description: Datasheet; ComponentLink2URL: https://www.we-online.com/catalog/datasheet/885012205009.pdf; Operating Temperature: -55 to +125degC; Packaging: Tape and Reel; Manufacturer Part Number: 885012205009; Published Date: April 2021; Ceramic Type: X7R; Height: 0.5mm; Mounting Technology: SMT; Size: 0402; Capacitance: 3.3nF; Q-Factor min.: -
C66 C70 C81 C83 = 885012205018: as C134 on sheet Clock; ComponentLink1Description: Manufacturer; ComponentLink1URL: http://www.we-online.de; ComponentLink2Description: Datasheet; ComponentLink2URL: https://www.we-online.com/catalog/datasheet/885012205018.pdf; Operating Temperature: -55 to +125degC; Packaging: Tape and Reel; Manufacturer Part Number: 885012205018; Published Date: April 2021; Ceramic Type: X7R; Height: 0.5mm; Mounting Technology: SMT; Size: 0402; Capacitance: 100nF; Q-Factor min.: -
C67 C82 = 885012205025: WCAP-CSGP Multilayer Ceramic Chip Capacitor, General Purpose, size 0402, X7R, 1nF, 16V; Manufacturer: Wurth Elektronik; Rated Voltage: 16VDC; Isolation Resistance  min.: 10GOhm; Capacitance Tolerance: +/-10%; Dissipation Factor max.: 3.5%; Technical Reference: X7R0402102K016DFCT10000; ComponentLink1Description: Manufacturer; ComponentLink1URL: http://www.we-online.de; ComponentLink2Description: Datasheet; ComponentLink2URL: https://www.we-online.com/catalog/datasheet/885012205025.pdf; Operating Temperature: -55 to +125degC; Packaging: Tape and Reel; Manufacturer Part Number: 885012205025; Published Date: April 2021; Ceramic Type: X7R; Height: 0.5mm; Mounting Technology: SMT; Size: 0402; Capacitance: 1nF; Q-Factor min.: -
FB1 FB2 = 742792034: WE-CBF SMT EMI Suppression Ferrite Bead, size 0805, 220Ohm, 2.8A; Manufacturer: Wurth Elektronik; Impedance max.: 300Ohm; DC Resistance max.: 0.3Ohm; Type: High Speed; ComponentLink1Description: Manufacturer; ComponentLink1URL: http://www.we-online.de; ComponentLink2Description: Datasheet; ComponentLink2URL: https://www.we-online.com/catalog/datasheet/742792034.pdf; Operating Temperature: -55 to +125degC; Packaging: Tape and Reel; Published Date: December 2021; Rated Current: 2.8A; Manufacturer Part Number: 742792034; Impedance @100MHz: 220Ohm; Mounting Technology: SMT; Size: 0805; Height: 0.9mm; Length: 2mm; Width: 1.2mm
L1-L8 = LQH2HPN1R0NJR: Wire Wound Ferrite Inductor; Manufacturer: Murata; Inductance: 470 nH - 22 µH; AEC 200: Grade 0; Length (mm): 2.5; Width (mm): 2; ComponentLink1Description: Manufacturer; ComponentLink1URL: https://www.murata.com/search/productsearch?cate=cgInductors&partno=LQH2HPN_JR&realtime=1&sort=d_inductance; Height (mm): 1.2; Operating temperature range (C): −40°C to +125°C; Series: LQH2HPN_JR; Supplier 1: Digi-Key; Supplier 2: Mouser; Supplier Part Number 1: 490-9898-1-ND; Supplier Part Number 2: 81-LQH2HPN1R0NJRL
R91 = ERJ2RKF4991X: General Purpose Thick Film Chip Resistors; Manufacturer: Panasonic; Power (0402): 0.1 W; Limiting Voltage (0402): 50; Maximum Voltage (0402): 100; Resistance Range (Ω): 1Ω to 100MΩ; AEC 200: Grade 0; Size (0402): 2GE; ComponentLink1Description: Catalog; ComponentLink1URL: https://industrial.panasonic.com/ww/products/pt/general-purpose-chip-resistors/models?op=search&model_status_current=1&page=0#model-list-search-results; Series: ERJ; Temperature Range (ºC): -55 to +155; Supplier 1: Digi-Key; Supplier Part Number 1: P4.99KLTR-ND
R92 R93 R96 R99 R104 = ERJ2RKF4703X: General Purpose Thick Film Chip Resistors; Manufacturer: Panasonic; Power (0402): 0.1 W; Limiting Voltage (0402): 50; Maximum Voltage (0402): 100; Resistance Range (Ω): 1Ω to 100MΩ; AEC 200: Grade 0; Size (0402): 2GE; ComponentLink1Description: Catalog; ComponentLink1URL: https://industrial.panasonic.com/ww/products/pt/general-purpose-chip-resistors/models?op=search&model_status_current=1&page=0#model-list-search-results; Series: ERJ; Temperature Range (ºC): -55 to +155; Supplier 1: Digi-Key; Supplier Part Number 1: P470KLCT-ND
R94 = ERJ2RKF4021X: General Purpose Thick Film Chip Resistors; Manufacturer: Panasonic; Power (0402): 0.1 W; Limiting Voltage (0402): 50; Maximum Voltage (0402): 100; Resistance Range (Ω): 1Ω to 100MΩ; AEC 200: Grade 0; Size (0402): 2GE; ComponentLink1Description: Catalog; ComponentLink1URL: https://industrial.panasonic.com/ww/products/pt/general-purpose-chip-resistors/models?op=search&model_status_current=1&page=0#model-list-search-results; Series: ERJ; Temperature Range (ºC): -55 to +155; Supplier 1: Digi-Key; Supplier 2: Digi-Key; Supplier Part Number 2: P4.02KLDKR-ND; Supplier Part Number 1: P4.02KLCT-ND
R95 = ERJ2RKF1503X: General Purpose Thick Film Chip Resistors; Manufacturer: Panasonic; Power (0402): 0.1 W; Limiting Voltage (0402): 50; Maximum Voltage (0402): 100; Resistance Range (Ω): 1Ω to 100MΩ; AEC 200: Grade 0; Size (0402): 2GE; ComponentLink1Description: Catalog; ComponentLink1URL: https://industrial.panasonic.com/ww/products/pt/general-purpose-chip-resistors/models?op=search&model_status_current=1&page=0#model-list-search-results; Series: ERJ; Temperature Range (ºC): -55 to +155; Supplier 1: Digi-Key; Supplier Part Number 1: P150KLCT-ND
R97 = ERJ2RKF9092X: General Purpose Thick Film Chip Resistors; Manufacturer: Panasonic; Power (0402): 0.1 W; Limiting Voltage (0402): 50; Maximum Voltage (0402): 100; Resistance Range (Ω): 1Ω to 100MΩ; AEC 200: Grade 0; Size (0402): 2GE; ComponentLink1Description: Catalog; ComponentLink1URL: https://industrial.panasonic.com/ww/products/pt/general-purpose-chip-resistors/models?op=search&model_status_current=1&page=0#model-list-search-results; Series: ERJ; Temperature Range (ºC): -55 to +155; Supplier 1: Mouser; Supplier Part Number 1: 667-ERJ-2RKF9092X; Supplier 2: Digi-Key; Supplier Part Number 2: P90.9KLCT-ND
R98 R101 R107 = ERJ2RKF1603X: General Purpose Thick Film Chip Resistors; Manufacturer: Panasonic; Power (0402): 0.1 W; Limiting Voltage (0402): 50; Maximum Voltage (0402): 100; Resistance Range (Ω): 1Ω to 100MΩ; AEC 200: Grade 0; Size (0402): 2GE; ComponentLink1Description: Catalog; ComponentLink1URL: https://industrial.panasonic.com/ww/products/pt/general-purpose-chip-resistors/models?op=search&model_status_current=1&page=0#model-list-search-results; Series: ERJ; Temperature Range (ºC): -55 to +155; Supplier 1: Digi-Key; Supplier Part Number 1: P160KLCT-ND
R100 = ERJ2RKF2003X: General Purpose Thick Film Chip Resistors; Manufacturer: Panasonic; Power (0402): 0.1 W; Limiting Voltage (0402): 50; Maximum Voltage (0402): 100; Resistance Range (Ω): 1Ω to 100MΩ; AEC 200: Grade 0; Size (0402): 2GE; ComponentLink1Description: Catalog; ComponentLink1URL: https://industrial.panasonic.com/ww/products/pt/general-purpose-chip-resistors/models?op=search&model_status_current=1&page=0#model-list-search-results; Series: ERJ; Temperature Range (ºC): -55 to +155; Supplier 1: Digi-Key; Supplier Part Number 1: P200KLCT-ND
R102 R103 R106 R108 = ERJ2RKF1002X: General Purpose Thick Film Chip Resistors; Manufacturer: Panasonic; Power (0402): 0.1 W; Limiting Voltage (0402): 50; Maximum Voltage (0402): 100; Resistance Range (Ω): 1Ω to 100MΩ; AEC 200: Grade 0; Size (0402): 2GE; ComponentLink1Description: Catalog; ComponentLink1URL: https://industrial.panasonic.com/ww/products/pt/general-purpose-chip-resistors/models?op=search&model_status_current=1&page=0#model-list-search-results; Series: ERJ; Temperature Range (ºC): -55 to +155; Supplier 1: Digi-Key; Supplier 2: Mouser; Supplier Part Number 1: P10.0KLCT-ND; Supplier Part Number 2: 667-ERJ-2RKF1002X
R105 = ERJ2RKF4022X: General Purpose Thick Film Chip Resistors; Manufacturer: Panasonic; Power (0402): 0.1 W; Limiting Voltage (0402): 50; Maximum Voltage (0402): 100; Resistance Range (Ω): 1Ω to 100MΩ; AEC 200: Grade 0; Size (0402): 2GE; ComponentLink1Description: Catalog; ComponentLink1URL: https://industrial.panasonic.com/ww/products/pt/general-purpose-chip-resistors/models?op=search&model_status_current=1&page=0#model-list-search-results; Series: ERJ; Temperature Range (ºC): -55 to +155; Supplier 1: Digi-Key; Supplier Part Number 1: P40.2KLTR-ND
U11 = TPS73801-SEP: Radiation-hardened, 2.2-V to 20-V, 1-A low-noise adjustable output LDO in Space Enhanced Plastic; Iout (Max) (A): 1; Vin (Max) (V): 20; Vin (Min) (V): 2.2; Vout (Min) (V): 1.21; ComponentLink1Description: Manufacturer; ComponentLink1URL: https://www.ti.com/product/TPS73801-SEP#pps; ComponentLink2Description: Datasheet; ComponentLink2URL: https://www.ti.com/lit/ds/symlink/tps73801-sep.pdf?ts=1639038776346&ref_url=https%253A%252F%252Fwww.ti.com%252Fproduct%252FTPS73801-SEP; Vout (Max) (V): 20; Iq (Typ) (mA): 1; Operating temperature range (C): -55 to 125; Radiation, TID (Typ) (krad): 50; Radiation, SEL (MeV.cm2/mg): 43; Rating: Space
U12-U14 U16 = TPS62180YZFT: TPS6218x 4-V to 15-V, 6-A, 2-Phase Step-Down Converters; Body Size (mm): 2.10 mm x 3.10 mm; Vin (Min) (V): 4; Vin (Max) (V): 15; Vout (Min) (V): 0.9; Vout (Max) (V): 6; Iq (Typ) (uA): 30; Switching frequency (Min) (kHz): 1000; Switching frequency (Max) (kHz): 2000; Rating: Catalog; Regulated outputs (#): 1; Package: DSBGA 24; Iout (Max) (A): 6; Operating temperature range (C): -40ºC to 125ºC; ComponentLink1Description: Manufacturer; ComponentLink1URL: https://www.ti.com/product/TPS62184; Supplier 1: Digi-Key; Supplier 2: Mouser; Supplier Part Number 1: 296-38369-6-ND; Supplier Part Number 2: 595-TPS62180YZFT
U15 U17 = TPS51200DRCT: 3A Sink/Source DDR Termination Regulator w/ VTTREF Buffered Reference for DDR2, DDR3, DDR3L and DDR4 10-VSON -40 to 85; MF: Texas Instruments; DDR memory type: DDR, DDR2, DDR3, DDR3L, LPDDR2, LPDDR3; Control mode: D-CAP, S4/S5; Iout VDDQ (Max) (A): 20; Iq (Typ) (mA): 0.6; Output: VDDQ, VREF, VTT; Vin (Min) (V): 3; Vin (Max) (V): 28; Rating: HiRel Enhanced Product; MP: TPS51200DRCT; Package: VSON-10; Supplier 1: Digi-Key; Supplier 2: Mouser; Supplier Part Number 1: 296-23830-1-ND; Supplier Part Number 2: 595-TPS51200DRCT; Iout VTT (Max) (A): *; Operating temperature range (C): -55ºC to 125ºC